# Altium project Prj_Master_Screen_V2.00.PrjPcb
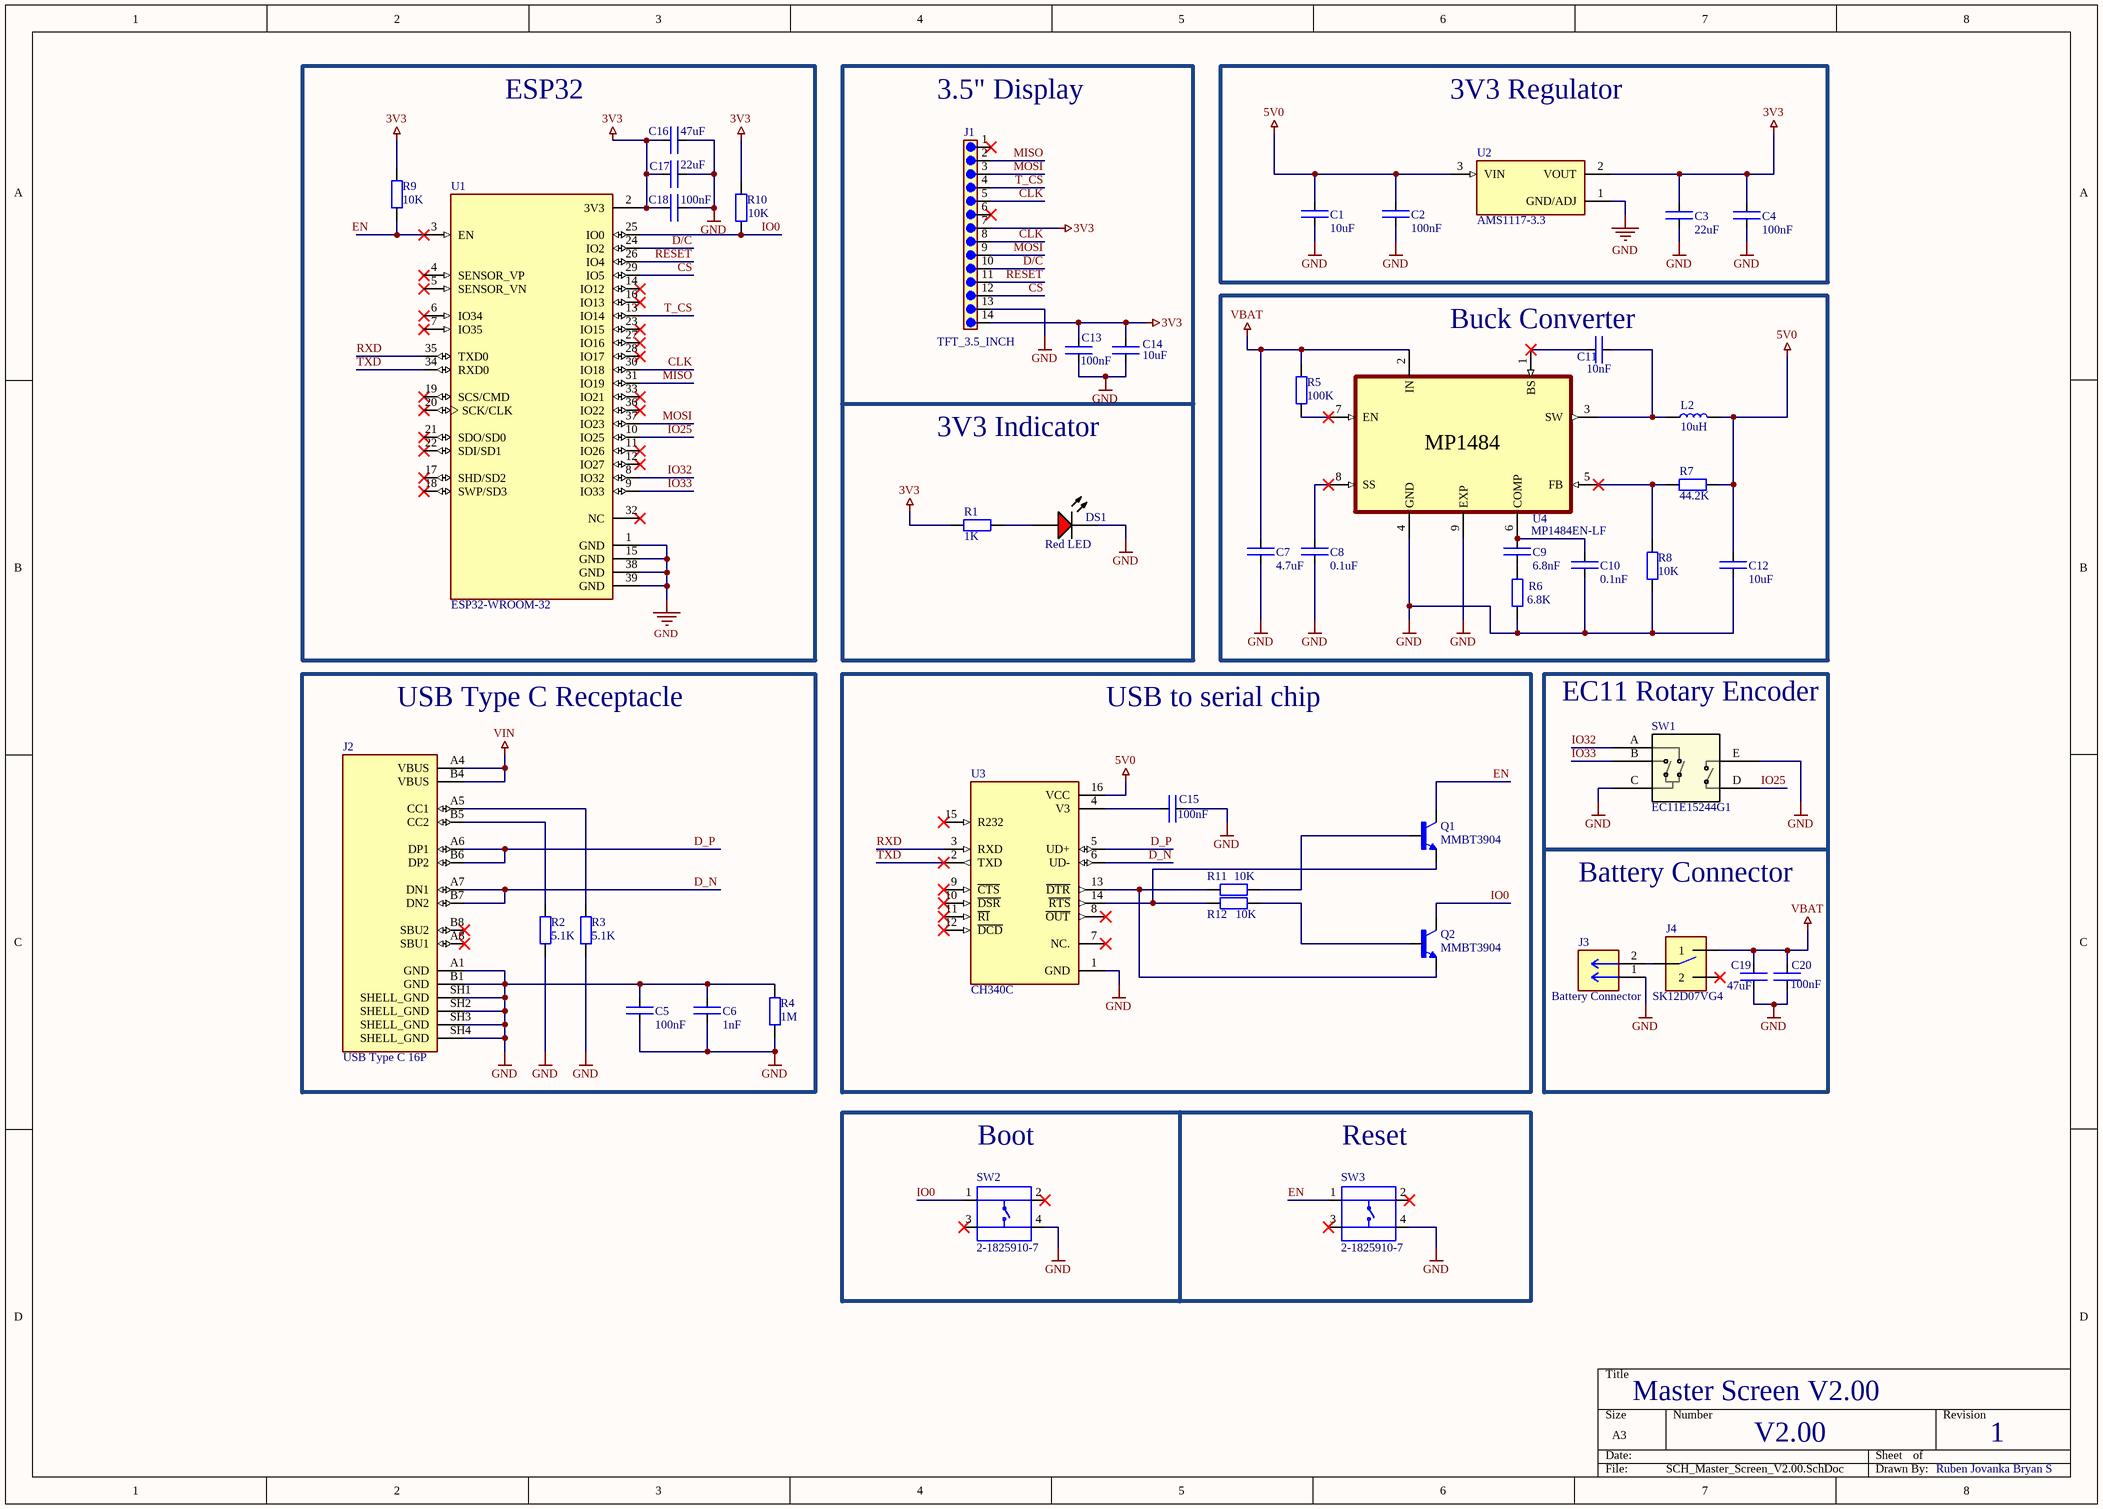
[diagram p0: SCH_Master_Screen_V2.00.SchDoc]
1 sheet, 47 parts. Net scope: global (net labels, ports and power ports of the same name join across sheets).
Board file: PCB_Master_Screen_V2.00.PcbDoc

## Sheet SCH_Master_Screen_V2.00.SchDoc
size A3; SheetNumber: 1; SheetTotal: 1

### Parts
C1  10uF  [CAP0805]
C2  100nF  [CAP0805]
C3  22uF  [CAP0805]
C4  100nF  [CAP0805]
C5  100nF  [CAP0805]
C6  1nF  [CAP0805]
C7  4.7uF  [CAP0805]
C8  0.1uF  [CAP0805]
C9  6.8nF  [CAP0805]
C10  0.1nF  [CAP0805]
C11  10nF  [CAP0805]
C12  10uF  [CAP0805]
C13  100nF  [CAP0805]
C14  10uF  [CAP0805]
C15  100nF  [CAP0805]
C16  47uF  [CAP0805]
C17  22uF  [CAP0805]
C18  100nF  [CAP0805]
C19  47uF  [CAP0805]
C20  100nF  [CAP0805]
DS1  Red LED  [LUMX-SML-LX1206IC_V]
J1  TFT_3.5_INCH  [61301411121]
J2  USB Type C 16P  [GCT_USB4105-GF-A-060]
J3  Battery Connector  [CONN_A-6373-02A_MOL]
J4  SK12D07VG4  [SK12D07VG4]
L2  10uH  [INDPM110100X400N]
Q1  MMBT3904  [TRANS_MMBT3904]
Q2  MMBT3904  [TRANS_MMBT3904]
R1  1K  [RES1206]
R2  5.1K  [RES1206]
R3  5.1K  [RES1206]
R4  1M  [RES1206]
R5  100K  [RES1206]
R6  6.8K  [RES1206]
R7  44.2K  [RES1206]
R8  10K  [RES1206]
R9  10K  [RES1206]
R10  10K  [RES1206]
R11  10K  [RES1206]
R12  10K  [RES1206]
SW1  EC11E15244G1  [EC11E15244G1_AAL]
SW2  2-1825910-7  [SW_2-1825910-7]
SW3  2-1825910-7  [SW_2-1825910-7]
U1  ESP32-WROOM-32  [MODULE_ESP32-WROOM-32]
U2  AMS1117-3.3  [SOT229P700X180-4N]
U3  CH340C  [SOIC127P600X180-16N]
U4  MP1484EN-LF  [SOIC127P600X170-9N]

### Blocks framed on the sheet
ESP32: C16-C18 R9 R10 U1
3V3 Regulator: C1-C4 U2
Buck Converter: C7-C12 L2 R5-R8 U4
USB Type C Receptacle: C5 C6 J2 R2-R4
USB to serial chip: C15 Q1 Q2 R11 R12 U3

### Nets
3V3: C3.1 C4.1 C13.2 C14.2 C16.1 C17.1 C18.1 J1.7 J1.14 R1.1 R9.2 R10.2 U1.2(3V3) U2.2(VOUT)
5V0: C1.2 C2.2 C12.2 L2.2 R7.2 U2.3(VIN) U3.16(VCC)
GND: C1.1 C2.1 C3.2 C4.2 C5.1 C5.2 C6.1 C6.2 C7.1 C8.1 C10.1 C12.1 C13.1 C14.1 C15.2 C16.2 C17.2 C18.2 C19.1 C20.1 DS1.2(K) J1.13 J2.A1(GND) J2.B1(GND) J2.SH1(SHELL_GND) J2.SH2(SHELL_GND) J2.SH3(SHELL_GND) J2.SH4(SHELL_GND) J3.1 R2.1 R3.1 R4.1 R4.2 R6.1 R8.1 SW1.C SW1.E SW2.4 SW3.4 U1.1(GND) U1.15(GND) U1.38(GND) U1.39(GND) U2.1(GND/ADJ) U3.1(GND) U4.4(GND) U4.9(EXP)
VBAT: C7.2 C19.2 C20.2 J4.1 R5.2 U4.2(IN)
VIN: J2.A4(VBUS) J2.B4(VBUS)
CLK: J1.5 J1.8 U1.30(IO18)
CS: J1.12 U1.29(IO5)
D/C: J1.10 U1.24(IO2)
D_N: J2.A7(DN1) J2.B7(DN2) U3.6(UD-)
D_P: J2.A6(DP1) J2.B6(DP2) U3.5(UD+)
EN: Q1.3(C) R9.1 SW3.1 U1.3(EN)
IO0: Q2.3(C) R10.1 SW2.1 U1.25(IO0)
IO25: SW1.D U1.10(IO25)
IO32: SW1.A U1.8(IO32)
IO33: SW1.B U1.9(IO33)
MISO: J1.2 U1.31(IO19)
MOSI: J1.3 J1.9 U1.37(IO23)
RESET: J1.11 U1.26(IO4)
RXD: U1.35(TXD0) U3.3(RXD)
T_CS: J1.4 U1.13(IO14)
TXD: U1.34(RXD0) U3.2(TXD)
NetC8_2: C8.2 U4.8(SS)
NetC9_1: C9.1 R6.2
NetC9_2: C9.2 C10.2 U4.6(COMP)
NetC11_1: C11.1 U4.1(BS)
NetC11_2: C11.2 L2.1 U4.3(SW)
NetC15_1: C15.1 U3.4(V3)
NetDS1_1: DS1.1(A) R1.2
NetJ2_A5: J2.A5(CC1) R3.2
NetJ2_B5: J2.B5(CC2) R2.2
NetJ3_2: J3.2 J4.COM
NetQ1_1: Q1.1(B) R11.1
NetQ1_2: Q1.2(E) R12.1 U3.14(~{RTS})
NetQ2_1: Q2.1(B) R12.2
NetQ2_2: Q2.2(E) R11.2 U3.13(~{DTR})
NetR5_1: R5.1 U4.7(EN)
NetR7_1: R7.1 R8.2 U4.5(FB)

Not connected (* = marked no-connect by the designer): J1 1* 6*; J2 A8(SBU1)* B8(SBU2)*; J4 2*; SW2 2* 3*; SW3 2* 3*; U1 4(SENSOR_VP)* 5(SENSOR_VN)* 6(IO34)* 7(IO35)* 11(IO26)* 12(IO27)* 14(IO12)* 16(IO13)* 17(SHD/SD2)* 18(SWP/SD3)* 19(SCS/CMD)* 20(SCK/CLK)* 21(SDO/SD0)* 22(SDI/SD1)* 23(IO15)* 27(IO16)* 28(IO17)* 32(NC)* 33(IO21)* 36(IO22)*; U3 7(NC.)* 8(~{OUT})* 9(~{CTS})* 10(~{DSR})* 11(~{RI})* 12(~{DCD})* 15(R232)*

### Notes on the sheet
- (near J1) 3.5" Display
- 3V3 Indicator
- (near SW1) EC11 Rotary Encoder
- Battery Connector
- (near SW2) Boot
- (near SW3) Reset
- Master Screen V2.00
- V2.00
- 1
- Ruben Jovanka Bryan S
- (in symbol MP1484EN-LF) MP1484

### Library data of the parts
C1-C20 = Capacitor 0805: Value: 805; MF: Yageo; MP: CC0805KRX7R9BB104; SnapEDA_Link: https://www.snapeda.com/parts/CC0805KRX7R9BB104/Yageo/view-part/?ref=snap; Package: 0805 Yageo; Check_prices: https://www.snapeda.com/parts/CC0805KRX7R9BB104/Yageo/view-part/?ref=eda; Part Number: Capacitor 0805; PartID: Capacitor 0805; TempMin: -55; TempMax: 125; Link: -
DS1 = CMP-2000-07123-1: LED Red, 65 mW, -40 to 85 degC, 2-Pin SMD, RoHS, Tape and Reel; Manufacturer: Lumex; Part No: SML-LX1206IC-TR; LED Material: GaAsP; Peak Wavelength: 635nm; Number of LEDs: 1; Viewing Angle: 160; Reverse Voltage: 5(Min)V; Lens Appearance: ColorlessNonDiffused; Intensity: 6mcd; Type: Uni-Color; Pin_Count: 2; Lens Dimensions: 2x1.6x0.5mm; Mounting: SurfaceMount; ECCN: EAR99; RoHS: Unknown; Package Description: 2-Pin Surface Mount Device, Body 3.2 x 1.5 mm; Mounting Technology: SurfaceMount; Dominant Wavelength: N/A; Supplier_Package: SMD; Supplier Standard Pack: 3,000; Color: Red; Dimension: 3.2x1.6x1.1mm; HTS: 8541402000; Family: SML-LX1206IC; Supplier: Lumex; Datasheet URL: http://www.lumex.com/content/files/ProductAttachment/SML-LX1206IC-TR.pdf; Package Reference: SML-LX1206IC; Manufacturer URL: http://www.lumexinstruments.com/; Operating Temperature: -25to85C; Packaging: TapeandReel; Datasheet Version: Rev. J, 08/2012
J1 = TFT-ILI9488: 3.5-inch TFT LCD (320 × 480) with ILI9488 driver + XPT2046 resistive touch; MF: WÃ¼rth Elektronik; SnapEDA_Link: https://www.snapeda.com/parts/61301411121/W%25C3%25BCrth+Elektronik+Midcom/view-part/?ref=snap; Package: None; Value: 3.5-inch TFT LCD (320 × 480); MP: 61301411121; Check_prices: https://www.snapeda.com/parts/61301411121/W%25C3%25BCrth+Elektronik+Midcom/view-part/?ref=eda; Part Number: TFT-ILI9488; PartID: TFT-ILI9488; TempMin: -30; TempMax: 85; Link: https://grabcad.com/library/3-5-color-spi-display-based-on-ili9488-chip-1
J2 = USB4105-GF-A-060: CONN RCP USB2.0 TYP C 16P SMD RA; Value: 16 Pin; MF: Global Connector Technology; MP: USB4105GFA060; SnapEDA_Link: https://www.snapeda.com/parts/USB4105GFA060/Global+Connector+Technology/view-part/?ref=snap; Package: None; Check_prices: https://www.snapeda.com/parts/USB4105GFA060/Global+Connector+Technology/view-part/?ref=eda; Part Number: USB4105-GF-A-060; PartID: USB4105-GF-A-060; TempMin: -40; TempMax: 85; Link: https://gct.co/files/specs/usb4105-spec.pdf
J3 = 22232021: Connector Header Through Hole 2 position 0.100" (2.54mm); Value: 2POS 2.54MM; MF: Molex; SnapEDA_Link: https://www.snapeda.com/parts/22232021/Molex/view-part/?ref=snap; Package: None; MP: 22232021; Check_prices: https://www.snapeda.com/parts/22232021/Molex/view-part/?ref=eda; Part Number: 22232021; PartID: 22232021; TempMin: -30; TempMax: 85; Link: https://www.molex.com/en-us/products/part-detail/0022232021
J4 = SK12D07VG4: Slide Switches - Side Knob; Value: 0.3A @ 30 VDC; MF: C&K; SnapEDA_Link: https://www.snapeda.com/parts/SK12D07VG4/C%2526K/view-part/?ref=snap; Package: None; MP: SK12D07VG4; Check_prices: https://www.snapeda.com/parts/SK12D07VG4/C%2526K/view-part/?ref=eda; Part Number: SK12D07VG4; PartID: SK12D07VG4; TempMin: -20; TempMax: 70; Link: https://www.snapeda.com/parts/SK12D07VG4/C&K/datasheet/
L2 = SRP1038AA-R36M: SMD Inductor 11x10mm; Manufacturer_Name: Bourns; Geometry.Height: 4mm; Value: 11 mm x 10 mm; Mouser Part Number: 652-SRP1038AA-R36M; Mouser Price/Stock: https://www.mouser.co.uk/ProductDetail/Bourns/SRP1038AA-R36M?qs=CiayqK2gdcJABH4%252B3%252B0pzQ%3D%3D; Manufacturer_Part_Number: SRP1038AA-R36M; Datasheet Link: https://www.bourns.com/docs/product-datasheets/srp1038aa.pdf?sfvrsn=2d1249f6_4; Part Number: SRP1038AA-R36M; PartID: SRP1038AA-R36M; TempMin: -55; TempMax: 155; Link: https://gct.co/files/specs/usb4105-spec.pdf
Q1 Q2 = MMBT3904: TRANS NPN 40V 0.2A SOT23-3; MF: Diotec Semiconductor; SnapEDA_Link: https://www.snapeda.com/parts/MMBT3904/Diotec/view-part/?ref=snap; Package: SOT-23 Diotec; Value: NPN; MP: MMBT3904; Check_prices: https://www.snapeda.com/parts/MMBT3904/Diotec/view-part/?ref=eda; Part Number: MMBT3904; PartID: MMBT3904; TempMin: -55; TempMax: 150; Link: https://diotec.com/request/datasheet/mmbt3904.pdf
R1-R12 = Resistor 1206: Value: 1206; Part Number: Resistor 1206; PartID: Resistor 1206; TempMin: -55; TempMax: 125; Link: -
SW1 = EC11E15244G1: EC11 Rotary Encoder with Switch; Manufacturer_Name: Alps Electric; Value: 10mA 5V DC; Type: Encoders; Copyright: Copyright (C) 2025 Ultra Librarian. All rights reserved.; Manufacturer_Part_Number: EC11E15244G1; RefDes: RefDes; Part Number: EC11E15244G1; PartID: EC11E15244G1; TempMin: -40; TempMax: 85; Link: https://tech.alpsalpine.com/e/products/detail/EC11E15244G1/
SW2 SW3 = SW_2-1825910-7: Button 6mm x 6mm; MF: TE Connectivity; Availability: Unavailable; EU_RoHS_Compliance: Compliant; Price: None; Package: None; Value: Button 6mm; SnapEDA_Link: https://www.snapeda.com/parts/2-1825910-7/TE%20Connectivity%20ALCOSWITCH%20Switches/view-part/498898/?ref=snap; TE_purchase_URL: https://www.te.com/usa-en/product-2-1825910-7.html?te_bu=Cor&te_type=disp&te_campaign=seda_glo_cor-seda-global-disp-prtnr-fy19-seda-model-bom-cta_sma-317_1&elqCampaignId=32493; MP: 2-1825910-7; Part Number: SW_2-1825910-7; PartID: SW_2-1825910-7; TempMin: -55; TempMax: 150; Link: https://www.digikey.de/de/products/detail/te-connectivity-alcoswitch-switches/2-1825910-7/1632528?srsltid=AfmBOorIgxPx8-RK9ZbRgtQifCi0fztvshC0t_fVXu46lzstz4pRWn6z
U1 = ESP32-WROOM-32: Bluetooth, WiFi 802.11b/g/n, Bluetooth v4.2 +EDR, Class 1, 2 and 3 Transceiver Module U.FL Surface Mount; Value: Dual Core, Wi-Fi, BLE; MF: Espressif Systems; Price: None; Availability: In Stock; MP: ESP32-WROOM-32; Package: Module Espressif Systems; SnapEDA_Link: https://www.snapeda.com/parts/ESP32-WROOM-32/Espressif+Systems/view-part/?ref=snap; Check_prices: https://www.snapeda.com/parts/ESP32-WROOM-32/Espressif+Systems/view-part/?ref=eda; Purchase-URL: https://pricing.snapeda.com/search/part/ESP32-WROOM-32/?ref=eda; Part Number: ESP32-WROOM-32; PartID: ESP32-WROOM-32; TempMin: -40; TempMax: 85; Link: https://documentation.espressif.com/esp32-wroom-32_datasheet_en.pdf
U2 = AMS1117-3.3: Linearer Spannungsregler, 800 mA, 15 V; Value: 0.8A, 15V; MF: Advanced Monolithic Systems; SnapEDA_Link: https://www.snapeda.com/parts/AMS1117-3.3/Advanced+Monolithic+Systems/view-part/?ref=snap; Package: SOT-223 Seeed Technology; MP: AMS1117-3.3; Check_prices: https://www.snapeda.com/parts/AMS1117-3.3/Advanced+Monolithic+Systems/view-part/?ref=eda; Part Number: AMS1117-3.3; PartID: AMS1117-3.3; TempMin: -40; TempMax: 125; Link: https://www.snapeda.com/parts/AMS1117-3.3/Advanced%20Monolithic%20Systems/datasheet/
U3 = CH340C: USB to serial chip; MF: WCH; Price: None; Availability: Not in stock; MP: CH340C; Package: None; SnapEDA_Link: https://www.snapeda.com/parts/CH340C/WCH/view-part/?ref=snap; Check_prices: https://www.snapeda.com/parts/CH340C/WCH/view-part/?ref=eda; Value: USB to serial chip; Part Number: CH340C; PartID: CH340C; TempMin: -30; TempMax: 85; Link: https://www.snapeda.com/parts/CH340C/WCH/datasheet/
U4 = MP1484EN-LF: Buck Switching Regulator IC Positive Adjustable 0.925V 1 Output 3A 8-SOIC (0.154", 3.90mm Width); Package: None; Price: None; Value: 0.925V 1 Output 3A; MP: MP1484EN-LF; Availability: Unavailable; Part Number: MP1484EN-LF; PartID: MP1484EN-LF; TempMin: -20; TempMax: 85; Link: https://www.digikey.at/de/products/detail/monolithic-power-systems-inc/MP1484EN-LF-Z/5291682?srsltid=AfmBOorvZqZweepwF19jqwdCHLwo1ck00ZSGZEtpVPLNX4bN2FRk_ecr